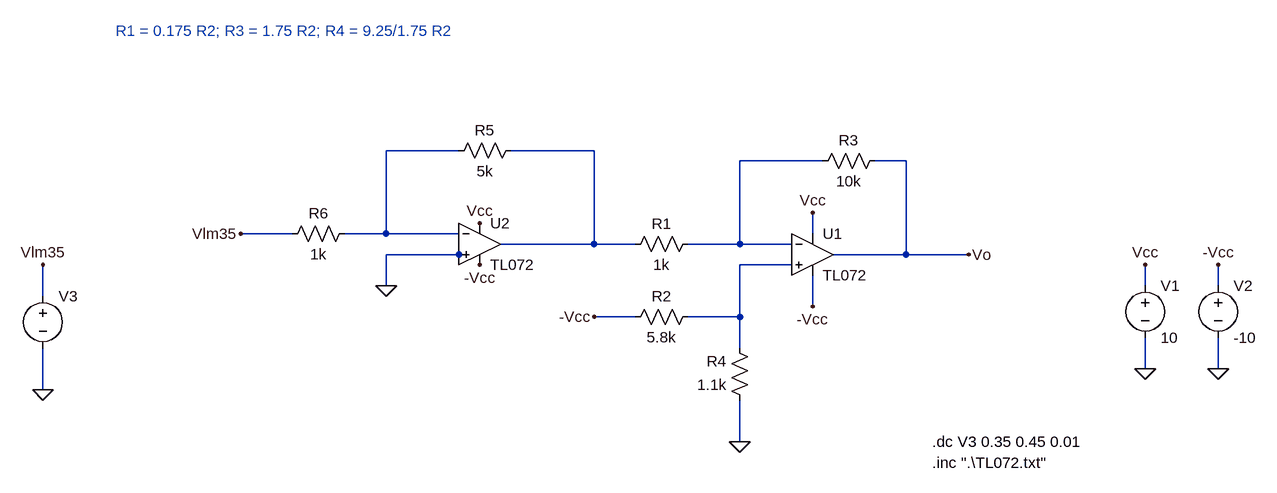
[diagram p0: schematic Circuito_1.asc]
Circuito_1.asc, the LTspice schematic file:
Version 4
SHEET 1 1860 680
WIRE 448 -160 336 -160
WIRE 656 -160 528 -160
WIRE 1008 -144 880 -144
WIRE 1136 -144 1088 -144
WIRE 192 -32 112 -32
WIRE 336 -32 336 -160
WIRE 336 -32 272 -32
WIRE 448 -32 336 -32
WIRE 992 -32 992 -64
WIRE 656 -16 656 -160
WIRE 656 -16 512 -16
WIRE 720 -16 656 -16
WIRE 880 -16 880 -144
WIRE 880 -16 800 -16
WIRE 960 -16 880 -16
WIRE 448 0 336 0
WIRE 464 0 448 0
WIRE 1136 0 1136 -144
WIRE 1136 0 1024 0
WIRE 1232 0 1136 0
WIRE 960 16 880 16
WIRE 336 48 336 0
WIRE 1504 48 1504 16
WIRE 1616 48 1616 16
WIRE -192 64 -192 16
WIRE 992 80 992 32
WIRE 720 96 656 96
WIRE 880 96 880 16
WIRE 880 96 800 96
WIRE 880 144 880 96
WIRE 1504 176 1504 128
WIRE 1616 176 1616 128
WIRE -192 208 -192 144
WIRE 880 288 880 224
FLAG 112 -32 Vlm35
FLAG 880 288 0
FLAG 1232 0 Vo
FLAG 992 -64 Vcc
FLAG 992 80 -Vcc
FLAG 1616 16 -Vcc
FLAG 1504 16 Vcc
FLAG 1504 176 0
FLAG 1616 176 0
FLAG -192 208 0
FLAG -192 16 Vlm35
FLAG 656 96 -Vcc
FLAG 480 -48 Vcc
FLAG 480 16 -Vcc
FLAG 336 48 0
SYMBOL res 816 -32 R90
WINDOW 0 0 56 VBottom 2
WINDOW 3 32 56 VTop 2
SYMATTR InstName R1
SYMATTR Value 1k
SYMBOL res 816 80 R90
WINDOW 0 0 56 VBottom 2
WINDOW 3 32 56 VTop 2
SYMATTR InstName R2
SYMATTR Value 5.8k
SYMBOL res 896 240 R180
WINDOW 0 36 76 Left 2
WINDOW 3 36 40 Left 2
SYMATTR InstName R4
SYMATTR Value 1.1k
SYMBOL voltage 1504 32 R0
SYMATTR InstName V1
SYMATTR Value 10
SYMBOL voltage 1616 32 R0
SYMATTR InstName V2
SYMATTR Value -10
SYMBOL voltage -192 48 R0
WINDOW 123 0 0 Left 0
WINDOW 39 0 0 Left 0
SYMATTR InstName V3
SYMATTR Value ""
SYMBOL res 1104 -160 R90
WINDOW 0 0 56 VBottom 2
WINDOW 3 32 56 VTop 2
SYMATTR InstName R3
SYMATTR Value 10k
SYMBOL Opamps\\opamp2 992 -64 R0
SYMATTR InstName U1
SYMATTR Value TL072
SYMBOL Opamps\\opamp2 480 -80 R0
SYMATTR InstName U2
SYMATTR Value TL072
SYMBOL res 544 -176 R90
WINDOW 0 0 56 VBottom 2
WINDOW 3 32 56 VTop 2
SYMATTR InstName R5
SYMATTR Value 5k
SYMBOL res 288 -48 R90
WINDOW 0 0 56 VBottom 2
WINDOW 3 32 56 VTop 2
SYMATTR InstName R6
SYMATTR Value 1k
TEXT 1176 320 Left 2 !.inc ".\\TL072.txt"
TEXT 1176 288 Left 2 !.dc V3 0.35 0.45 0.01
TEXT -80 -344 Left 2 ;R1 = 0.175 R2; R3 = 1.75 R2; R4 = 9.25/1.75 R2

The netlist it stands for:
* Circuito_1.asc
R1 N003 N002 1k
R2 N004 -Vcc 5.8k
R4 0 N004 1.1k
V1 Vcc 0 10
V2 -Vcc 0 -10
V3 Vlm35 0
R3 Vo N003 10k
XU1 N004 N003 Vcc -Vcc Vo TL072  ; pins In+ In- V+ V- OUT
XU2 0 N001 Vcc -Vcc N002 TL072  ; pins In+ In- V+ V- OUT
R5 N002 N001 5k
R6 N001 Vlm35 1k
.inc ".\TL072.txt"
.dc V3 0.35 0.45 0.01
* R1 = 0.175 R2; R3 = 1.75 R2; R4 = 9.25/1.75 R2
.backanno
.end